# Altium schematic sheet MAXIM-ADC.SchDoc
size B
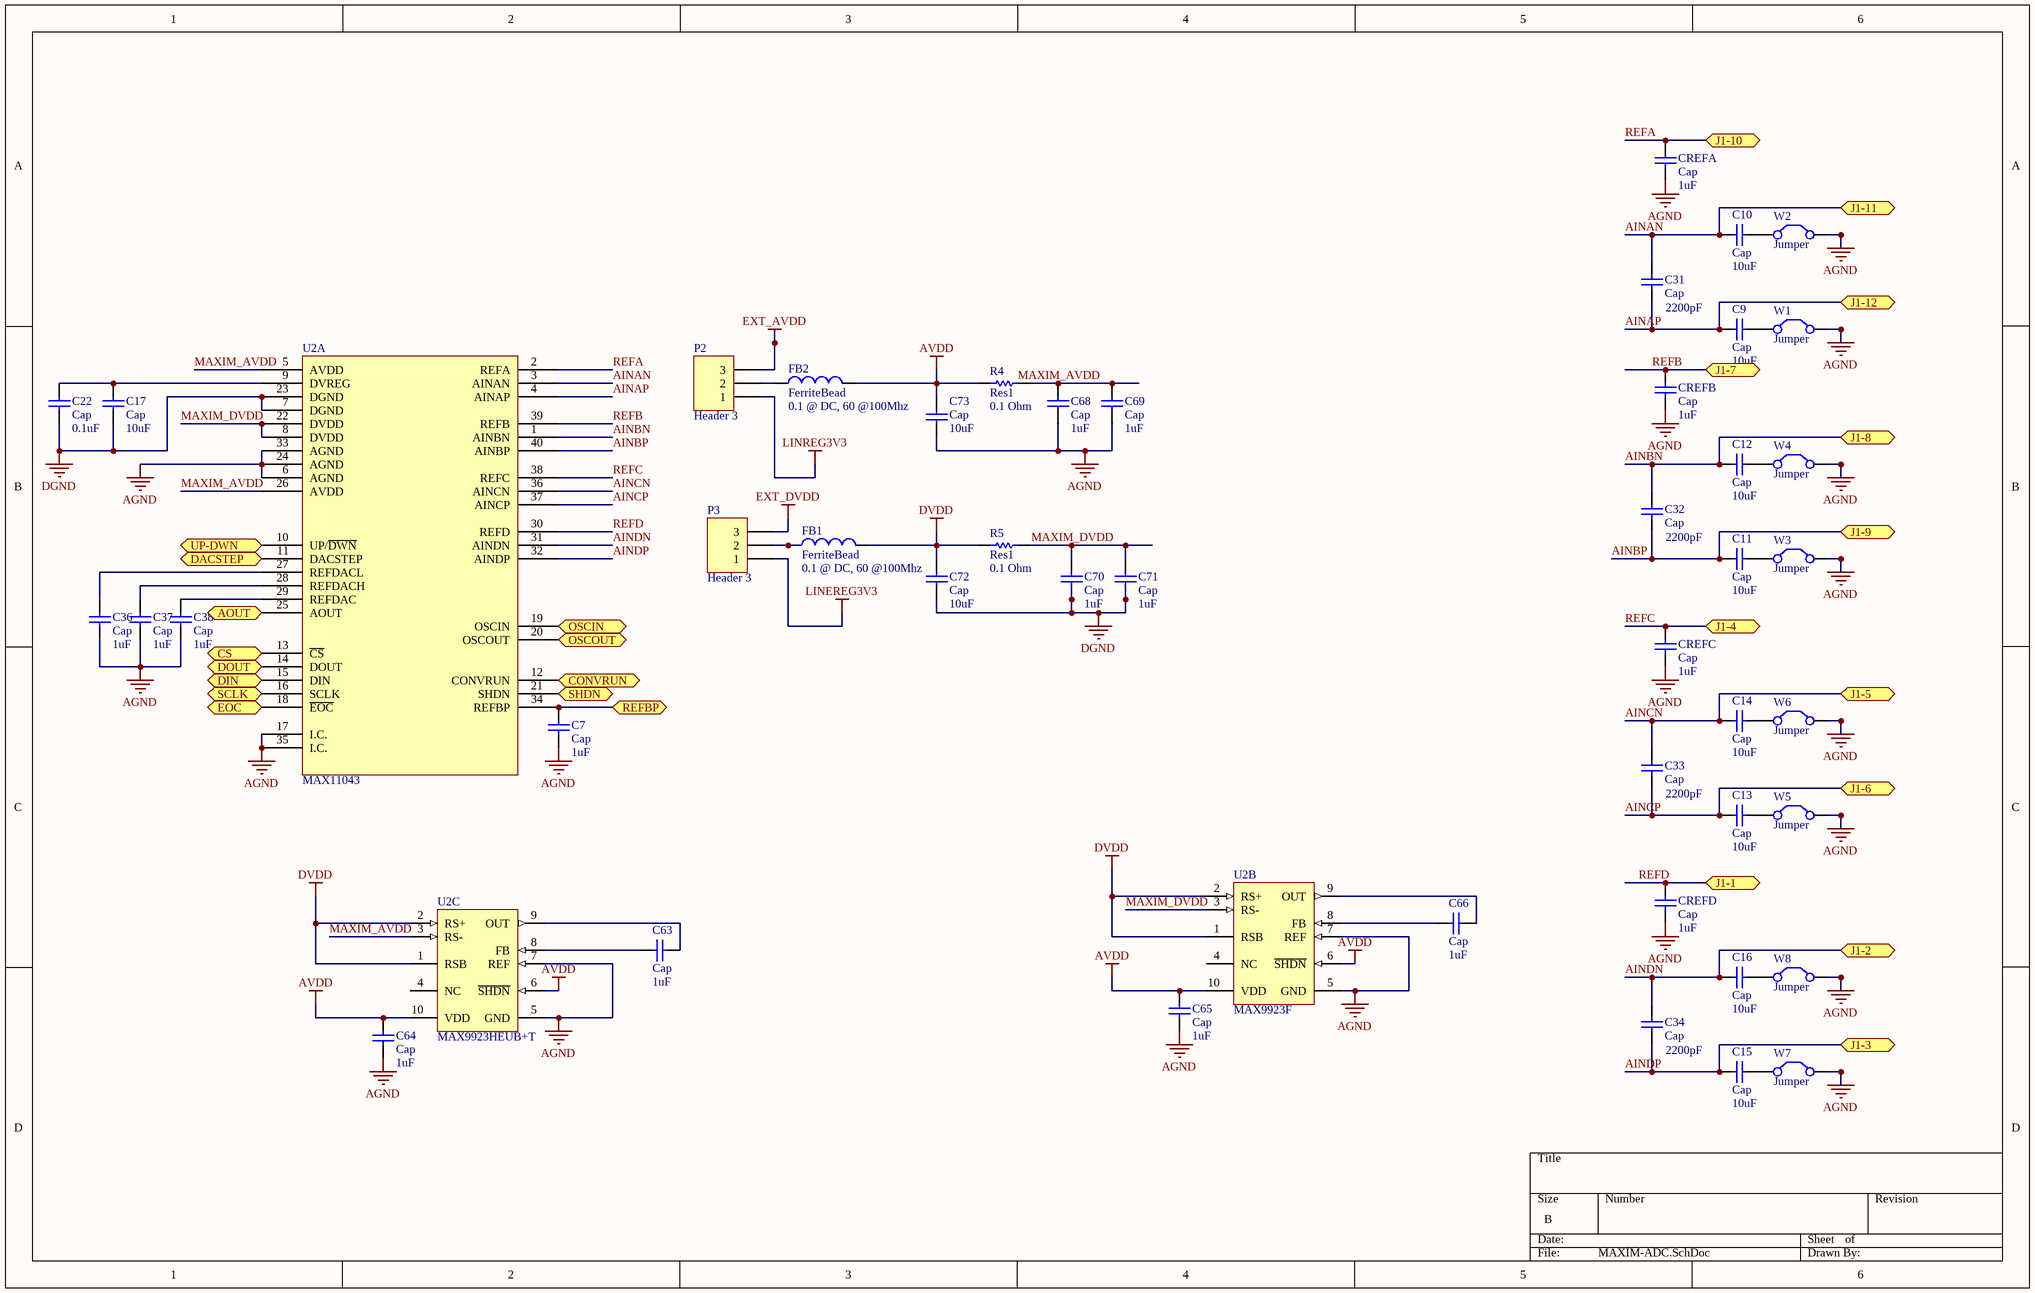
[diagram p0: MAXIM-ADC.SchDoc]

## Parts
C7  Cap  value 1uF  [RAD-0.3]
C9  Cap  value 10uF  [RAD-0.3]
C10  Cap  value 10uF  [RAD-0.3]
C11  Cap  value 10uF  [RAD-0.3]
C12  Cap  value 10uF  [RAD-0.3]
C13  Cap  value 10uF  [RAD-0.3]
C14  Cap  value 10uF  [RAD-0.3]
C15  Cap  value 10uF  [RAD-0.3]
C16  Cap  value 10uF  [RAD-0.3]
C17  Cap  value 10uF  [RAD-0.3]
C22  Cap  value 0.1uF  [RAD-0.3]
C31  Cap  value 2200pF  [RAD-0.3]
C32  Cap  value 2200pF  [RAD-0.3]
C33  Cap  value 2200pF  [RAD-0.3]
C34  Cap  value 2200pF  [RAD-0.3]
C36  Cap  value 1uF  [RAD-0.3]
C37  Cap  value 1uF  [RAD-0.3]
C38  Cap  value 1uF  [RAD-0.3]
C63  Cap  value 1uF  [RAD-0.3]
C64  Cap  value 1uF  [RAD-0.3]
C65  Cap  value 1uF  [RAD-0.3]
C66  Cap  value 1uF  [RAD-0.3]
C68  Cap  value 1uF  [0603]
C69  Cap  value 1uF  [RAD-0.3]
C70  Cap  value 1uF  [RAD-0.3]
C71  Cap  value 1uF  [RAD-0.3]
C72  Cap  value 10uF  [RAD-0.3]
C73  Cap  value 10uF  [RAD-0.3]
CREFA  Cap  value 1uF  [RAD-0.3]
CREFB  Cap  value 1uF  [RAD-0.3]
CREFC  Cap  value 1uF  [RAD-0.3]
CREFD  Cap  value 1uF  [RAD-0.3]
FB1  FerriteBead  value 0.1 @ DC, 60 @100Mhz  [0603]
FB2  FerriteBead  value 0.1 @ DC, 60 @100Mhz  [0603]
P2  Header 3  [HDR1X3]
P3  Header 3  [HDR1X3]
R4  Res1  value 0.1 Ohm  [AXIAL-0.3]
R5  Res1  value 0.1 Ohm  [AXIAL-0.3]
U2A  MAX11043
U2B  MAX9923F  [MAXM-U10+2_N]
U2C  MAX9923HEUB+T  [MAXM-U10+2_N]
W1  Jumper  [RAD-0.2]
W2  Jumper  [RAD-0.2]
W3  Jumper  [RAD-0.2]
W4  Jumper  [RAD-0.2]
W5  Jumper  [RAD-0.2]
W6  Jumper  [RAD-0.2]
W7  Jumper  [RAD-0.2]
W8  Jumper  [RAD-0.2]

## Ports
AOUT, CONVRUN, CS, DACSTEP, DIN, DOUT, EOC, J1-1, J1-2, J1-3, J1-4, J1-5, J1-6, J1-7, J1-8, J1-9, J1-10, J1-11, J1-12, OSCIN, OSCOUT, REFBP, SCLK, SHDN, UP-DWN

## Nets
AGND: C7.2 C36.1 C37.2 C38.1 C64.1 C65.1 C68.2 C69.2 C73.2 CREFA.1 CREFB.1 CREFC.1 CREFD.1 U2A.6(AGND) U2A.17(I.C.) U2A.24(AGND) U2A.33(AGND) U2A.35(I.C.) U2B.5(GND) U2B.7(REF) U2C.5(GND) U2C.7(REF) W1.2(C2) W2.2(C2) W3.2(C2) W4.2(C2) W5.2(C2) W6.2(C2) W7.2(C2) W8.2(C2)
AVDD: C64.2 C65.2 C73.1 FB2.2 R4.2 U2B.6(~{SHDN}) U2B.10(VDD) U2C.6(~{SHDN}) U2C.10(VDD)
DGND: C17.2 C22.2 C70.2 C71.2 C72.2 U2A.7(DGND) U2A.23(DGND)
DVDD: C72.1 FB1.2 R5.2 U2B.1(RSB) U2B.2(RS+) U2C.1(RSB) U2C.2(RS+)
EXT_AVDD: P2.3
EXT_DVDD: P3.3
LINEREG3V3: P3.1
LINREG3V3: P2.1
AINAN: C10.2 C31.2 U2A.3(AINAN) ; port J1-11
AINAP: C9.2 C31.1 U2A.4(AINAP) ; port J1-12
AINBN: C12.2 C32.2 U2A.1(AINBN) ; port J1-8
AINBP: C11.2 C32.1 U2A.40(AINBP) ; port J1-9
AINCN: C14.2 C33.2 U2A.36(AINCN) ; port J1-5
AINCP: C13.2 C33.1 U2A.37(AINCP) ; port J1-6
AINDN: C16.2 C34.2 U2A.31(AINDN) ; port J1-2
AINDP: C15.2 C34.1 U2A.32(AINDP) ; port J1-3
AOUT: U2A.25(AOUT) ; port AOUT
CONVRUN: U2A.12(CONVRUN) ; port CONVRUN
CS: U2A.13(~{CS}) ; port CS
DACSTEP: U2A.11(DACSTEP) ; port DACSTEP
DIN: U2A.15(DIN) ; port DIN
DOUT: U2A.14(DOUT) ; port DOUT
EOC: U2A.18(~{EOC}) ; port EOC
MAXIM_AVDD: U2A.5(AVDD) U2A.26(AVDD) U2C.3(RS-)
MAXIM_DVDD: C70.1 C71.1 R5.1 U2A.8(DVDD) U2A.22(DVDD) U2B.3(RS-)
OSCIN: U2A.19(OSCIN) ; port OSCIN
OSCOUT: U2A.20(OSCOUT) ; port OSCOUT
REFA: CREFA.2 U2A.2(REFA) ; port J1-10
REFB: CREFB.2 U2A.39(REFB) ; port J1-7
REFBP: C7.1 U2A.34(REFBP) ; port REFBP
REFC: CREFC.2 U2A.38(REFC) ; port J1-4
REFD: CREFD.2 U2A.30(REFD) ; port J1-1
SCLK: U2A.16(SCLK) ; port SCLK
SHDN: U2A.21(SHDN) ; port SHDN
UP-DWN: U2A.10(UP/~{DWN}) ; port UP-DWN
NetC9_1: C9.1 W1.1(C1)
NetC10_1: C10.1 W2.1(C1)
NetC11_1: C11.1 W3.1(C1)
NetC12_1: C12.1 W4.1(C1)
NetC13_1: C13.1 W5.1(C1)
NetC14_1: C14.1 W6.1(C1)
NetC15_1: C15.1 W7.1(C1)
NetC16_1: C16.1 W8.1(C1)
NetC17_1: C17.1 C22.1 U2A.9(DVREG)
NetC36_2: C36.2 U2A.27(REFDACL)
NetC37_1: C37.1 U2A.28(REFDACH)
NetC38_2: C38.2 U2A.29(REFDAC)
NetC63_1: C63.1 U2C.8(FB)
NetC63_2: C63.2 U2C.9(OUT)
NetC66_1: C66.1 U2B.8(FB)
NetC66_2: C66.2 U2B.9(OUT)
NetC68_1: C68.1 C69.1 R4.1
NetFB1_1: FB1.1 P3.2
NetFB2_1: FB2.1 P2.2

Not connected (* = marked no-connect by the designer): U2B 4(NC); U2C 4(NC)

## Notes on the sheet
- Labels drawn without touching a wire or pin: MAXIM_AVDD

## Library data of the parts
C7 C9-C17 C22 C31-C34 C36-C38 C63-C66 C68-C73 CREFA CREFB CREFC CREFD = Cap: Capacitor; Published: 8-Jun-2000; LatestRevisionDate: 17-Jul-2002; LatestRevisionNote: Re-released for DXP Platform.; PackageReference: RAD-0.3; Publisher: Altium Limited; PackageDescription: Radial Cap, Thru-Hole; 2 Leads; 0.3 in Pin Spacing
FB1 FB2 = Inductor: Code_IEC: 1005; Published: 8-Jun-2000; LatestRevisionDate: 29-May-2009; LatestRevisionNote: IPC-7351 Footprint Added.; PackageReference: 0402-A; Publisher: Altium Limited; PackageDescription: Chip Inductor; Code_JEITA: 0402
P2 P3 = Header 3: Header, 3-Pin; LatestRevisionDate: 17-Jul-2002; LatestRevisionNote: Re-released for DXP Platform.; Publisher: Altium Limited
R4 R5 = Res1: Resistor; Published: 8-Jun-2000; LatestRevisionDate: 17-Jul-2002; LatestRevisionNote: Re-released for DXP Platform.; PackageReference: AXIAL-0.3; Publisher: Altium Limited; PackageDescription: Axial Device, Thru-Hole; 2 Leads; 0.3 in Pin Spacing
U2B = CMP-0252-00092-1: Ultra-Precision, High-Side Current-Sense Amplifier with Fixed Gain, 100 V / V Gain, -40 to 85 degC, 10-Pin SOP (U10+2), Pb-Free, Tape and Reel; PartNumber: MAX9923HEUB+T; Gain: 25 V/V, 100 V/V ,250 V/V; Bi-Dir. Curr. Sense: Yes; ComponentLink3Description: Package Specification; ComponentLink2Description: Datasheet; ComponentLink1Description: Manufacturer URL; ComponentLink3URL: http://pdfserv.maximintegrated.com/package_dwgs/21-0061.PDF; PackageReference: U10+2; PackageDescription: 10-Pin Micro-MAX, Thin Shrink Small-Outline (U10+2), Body 3 x 3 mm, Pitch 0.5 mm; PackageVersion: Rev. L, 07/2008; Mounting Technology: Surface Mount; ComponentLink2URL: http://datasheets.maximintegrated.com/en/ds/MAX9922-MAX9923.pdf; ComponentLink1URL: http://www.maximintegrated.com/; Code_JEDEC: MO-187; DatasheetVersion: Rev. 1
U2C = CMP-0252-00092-1: Ultra-Precision, High-Side Current-Sense Amplifier with Fixed Gain, 100 V / V Gain, -40 to 85 degC, 10-Pin SOP (U10+2), Pb-Free, Tape and Reel; Gain: 25 V/V, 100 V/V ,250 V/V; Bi-Dir. Curr. Sense: Yes; PartNumber: MAX9923HEUB+T; ComponentLink3Description: Package Specification; ComponentLink2Description: Datasheet; ComponentLink1Description: Manufacturer URL; ComponentLink3URL: http://pdfserv.maximintegrated.com/package_dwgs/21-0061.PDF; PackageReference: U10+2; PackageDescription: 10-Pin Micro-MAX, Thin Shrink Small-Outline (U10+2), Body 3 x 3 mm, Pitch 0.5 mm; PackageVersion: Rev. L, 07/2008; Mounting Technology: Surface Mount; ComponentLink2URL: http://datasheets.maximintegrated.com/en/ds/MAX9922-MAX9923.pdf; ComponentLink1URL: http://www.maximintegrated.com/; Code_JEDEC: MO-187; DatasheetVersion: Rev. 1
W1-W8 = Jumper: Jumper Wire; Published: 24-Mar-1999; LatestRevisionDate: 17-Jul-2002; LatestRevisionNote: Re-released for DXP Platform.; PackageReference: RAD-0.2; Publisher: Altium Limited; PackageDescription: Radial Cap, Thru-Hole; 2 Leads; 0.2 in Pin Spacing